# EAGLE schematic brain (EAGLE 8.3.2)
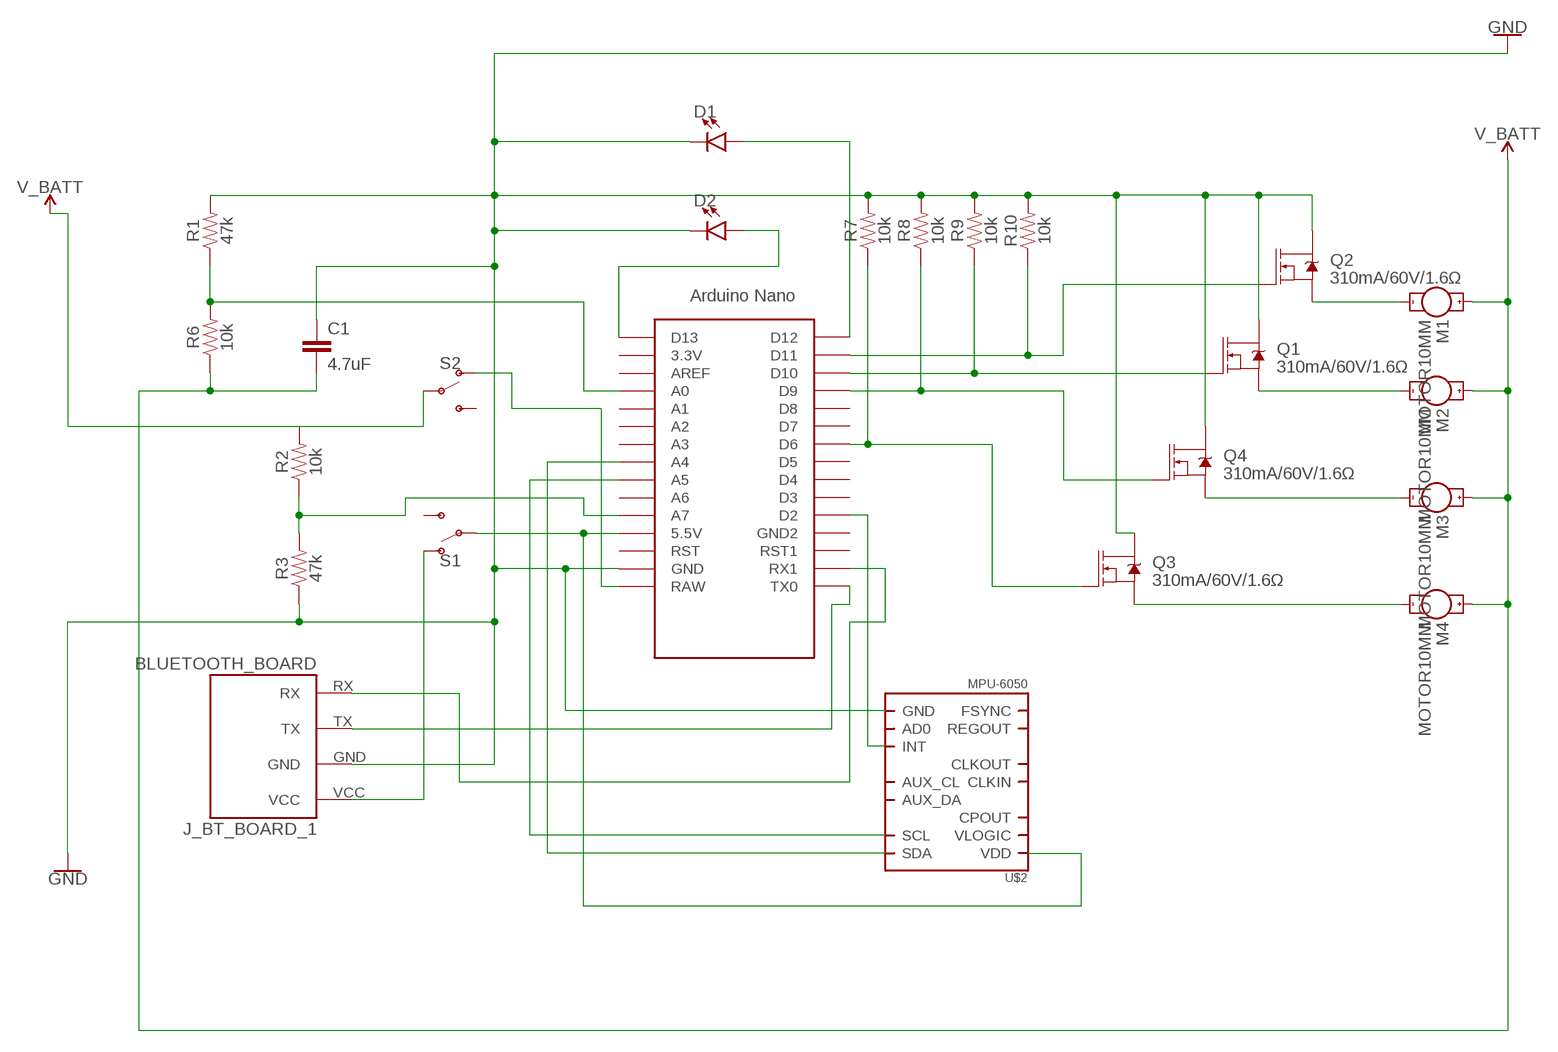
[diagram p0: schematic, sheet 1]

## Parts
C1  4.7uF  4.7UF-1206-16V-(+80/-20%)  [1206]
D1  LED5MM  [LED_5MM]
D2  LED5MM  [LED_5MM]
J_BT_BOARD_1  BLUETOOTH_BOARD  [BT_BOARD_FOOTPRINT]
M1  MOTOR10MM  [VIBE-MOTOR-10MM]
M2  MOTOR10MM  [VIBE-MOTOR-10MM]
M3  MOTOR10MM  [VIBE-MOTOR-10MM]
M4  MOTOR10MM  [VIBE-MOTOR-10MM]
Q1  310mA/60V/1.6Ω  MOSFET-NCH-2N7002PW  [SOT323]
Q2  310mA/60V/1.6Ω  MOSFET-NCH-2N7002PW  [SOT323]
Q3  310mA/60V/1.6Ω  MOSFET-NCH-2N7002PW  [SOT323]
Q4  310mA/60V/1.6Ω  MOSFET-NCH-2N7002PW  [SOT323]
R1  47k  47KOHM-0603-1/10W-1%  [0603]
R2  10k  10KOHM-HORIZ-1/4W-1%  [AXIAL-0.3]
R3  47k  47KOHM-0603-1/10W-1%  [0603]
R6  10k  10KOHM-HORIZ-1/4W-1%  [AXIAL-0.3]
R7  10k  10KOHM-HORIZ-1/4W-1%  [AXIAL-0.3]
R8  10k  10KOHM-HORIZ-1/4W-1%  [AXIAL-0.3]
R9  10k  10KOHM-HORIZ-1/4W-1%  [AXIAL-0.3]
R10  10k  10KOHM-HORIZ-1/4W-1%  [AXIAL-0.3]
S1  SWITCH-SPDT-PTH-11.6X4.0MM  [SWITCH_SPDT_PTH_11.6X4.0MM]
S2  SWITCH-SPDT-PTH-11.6X4.0MM  [SWITCH_SPDT_PTH_11.6X4.0MM]
U$1  NANO  [NANO]
U$2  MPU-6050  [QFN.24.4X4]

## Nets
GND: C1.1 D1.K(C) D2.K(C) J_BT_BOARD_1.GND Q1.3(D) Q2.3(D) Q3.3(D) Q4.3(D) R1.2 R3.1 R7.P$2 R8.P$2 R9.P$2 R10.P$2 U$1.GND U$2.18(GND)
N$1: Q2.1(G) R10.P$1 U$1.D11
N$2: Q1.1(G) R9.P$1 U$1.D10
N$3: Q4.1(G) R8.P$1 U$1.D9
N$4: Q3.1(G) R7.P$1 U$1.D6
N$5: S1.2(P) U$1.5V(5.5V) U$2.13(VDD)
N$6: J_BT_BOARD_1.VCC S1.1(O)
N$7: U$1.D2 U$2.12(INT)
N$8: U$1.A5 U$2.23(SCL)
N$9: U$1.A4 U$2.24(SDA)
N$10: J_BT_BOARD_1.RX U$1.RX1
N$11: J_BT_BOARD_1.TX U$1.TX0
N$12: S2.1(O) U$1.RAW
N$13: M1.- Q2.2(S)
N$14: M2.- Q1.2(S)
N$15: M3.- Q4.2(S)
N$16: M4.- Q3.2(S)
N$17: R1.1 R6.P$2 U$1.A0
N$18: R2.P$1 R3.2 U$1.A7
N$19: D1.A U$1.D12
N$20: D2.A U$1.D13
V_BATT: C1.2 M1.+ M2.+ M3.+ M4.+ R6.P$1 S2.2(P)
Unconnected: R2.P$2 S1.3(S) S2.3(S) U$1.3.3V U$1.A1 U$1.A2 U$1.A3 U$1.A6 U$1.AREF U$1.D3 U$1.D4 U$1.D5 U$1.D7 U$1.D8 U$1.GND1(GND2) U$1.ICSP1 U$1.ICSP2 U$1.ICSP3 U$1.ICSP4 U$1.ICSP5 U$1.ICSP6 U$1.RST U$1.RST1 U$2.1(CLKIN) U$2.6(AUX_DA) U$2.7(AUX_CL) U$2.8(VLOGIC) U$2.9(AD0) U$2.10(REGOUT) U$2.11(FSYNC) U$2.20(CPOUT) U$2.22(CLKOUT)

## Library data of the parts
C1 = SparkFun-Capacitors:4.7UF: 4.7µF ceramic capacitors A capacitor is a passive two-terminal electrical component used to store electrical energy temporarily in an electric field.; PROD_ID: CAP-10300
D1 D2 = SparkFun-LED:LED: LED (Generic) Standard schematic elements and footprints for 5mm, 3mm, 1206, and 0603 sized LEDs. Generic LEDs with no color specified.
J_BT_BOARD_1 = Bluetooth HC-05:BLUETOOTH_BOARD: Bluetooth Board V1.05
M1-M4 = SparkFun-Electromechanical:MOTOR: Motor (Single-Phase) Two-terminal, single-phase motors. SparkFun Products Vibration Motor <https://www.sparkfun.com/products/8449> (ROB-08449) Physical dimension and wire connections for this powerful vibration motor. Motor has a self adhesive backing.; PROD_ID: COMP-08572; SF_SKU: ROB-08449
Q1-Q4 = SparkFun-DiscreteSemi:MOSFET-NCH: N-channel MOSFETs Voltage controlled devices that allow control of high current outputs. SparkFun Products: SparkFun OpenScale <https://www.sparkfun.com/products/13261> SparkFun Digital Sandbox <https://www.sparkfun.com/products/12651> SparkFun Monster Moto Shield <https://www.sparkfun.com/products/10182> SparkFun MOSFET Power Controller <https://www.sparkfun.com/products/11214>; PROD_ID: TRANS-11151
R1 R3 = SparkFun-Resistors:47KOHM: 47kΩ resistor A resistor is a passive two-terminal electrical component that implements electrical resistance as a circuit element. Resistors act to reduce current flow, and, at the same time, act to lower voltage levels within circuits. - Wikipedia; PROD_ID: RES-07871
R2 R6-R10 = SparkFun-Resistors:10KOHM: 10kΩ resistor A resistor is a passive two-terminal electrical component that implements electrical resistance as a circuit element. Resistors act to reduce current flow, and, at the same time, act to lower voltage levels within circuits. - Wikipedia; PROD_ID: RES-12183
S1 S2 = SparkFun-Switches:SWITCH-SPDT: Single Pole, Double Throw (SPDT) Switch Single-pole, double-throw (SPDT) switch. Variant Overview SMD-AYZ0202 Surface Mount DPDT Switch <https://www.sparkfun.com/products/597> (COM-00597) Used on e.g. LilyPad Arduino USB - ATmega32U4 Board <https://www.sparkfun.com/products/12049> PTH-11.6X4.0MM SPDT Mini Power Switch <https://www.sparkfun.com/products/102> (COM-00102) Used on e.g. SparkFun Simon Says - Through-Hole Soldering Kit <https://www.sparkfun.com/products/10547> (KIT-10547) PTH-11.6X4.0MM-KIT KIT version of SPDT Mini Power Switch - Simplifies soldering by removing tStop of switch pins - only one side can be soldered. PTH-11.6X4.0MM-LOCK LOCK version of SPDT Mini Power Switch - Offset pins hold switch in place for easier soldering. SMD-RIGHT-ANGLE Surface Mount Right Angle Switch <https://www.sparkfun.com/products/10860> (COM-10860) Used on e.g. SparkFun ESP8266 Thing <https://www.sparkfun.com/products/13231>; PROD_ID: SWCH-08261; SF_SKU: COM-00102
U$1 = Arduino-clone:NANO: Arduino Nano
U$2 = invensense:MPU-6050